# EAGLE design Nyan (EAGLE 6.6.0)
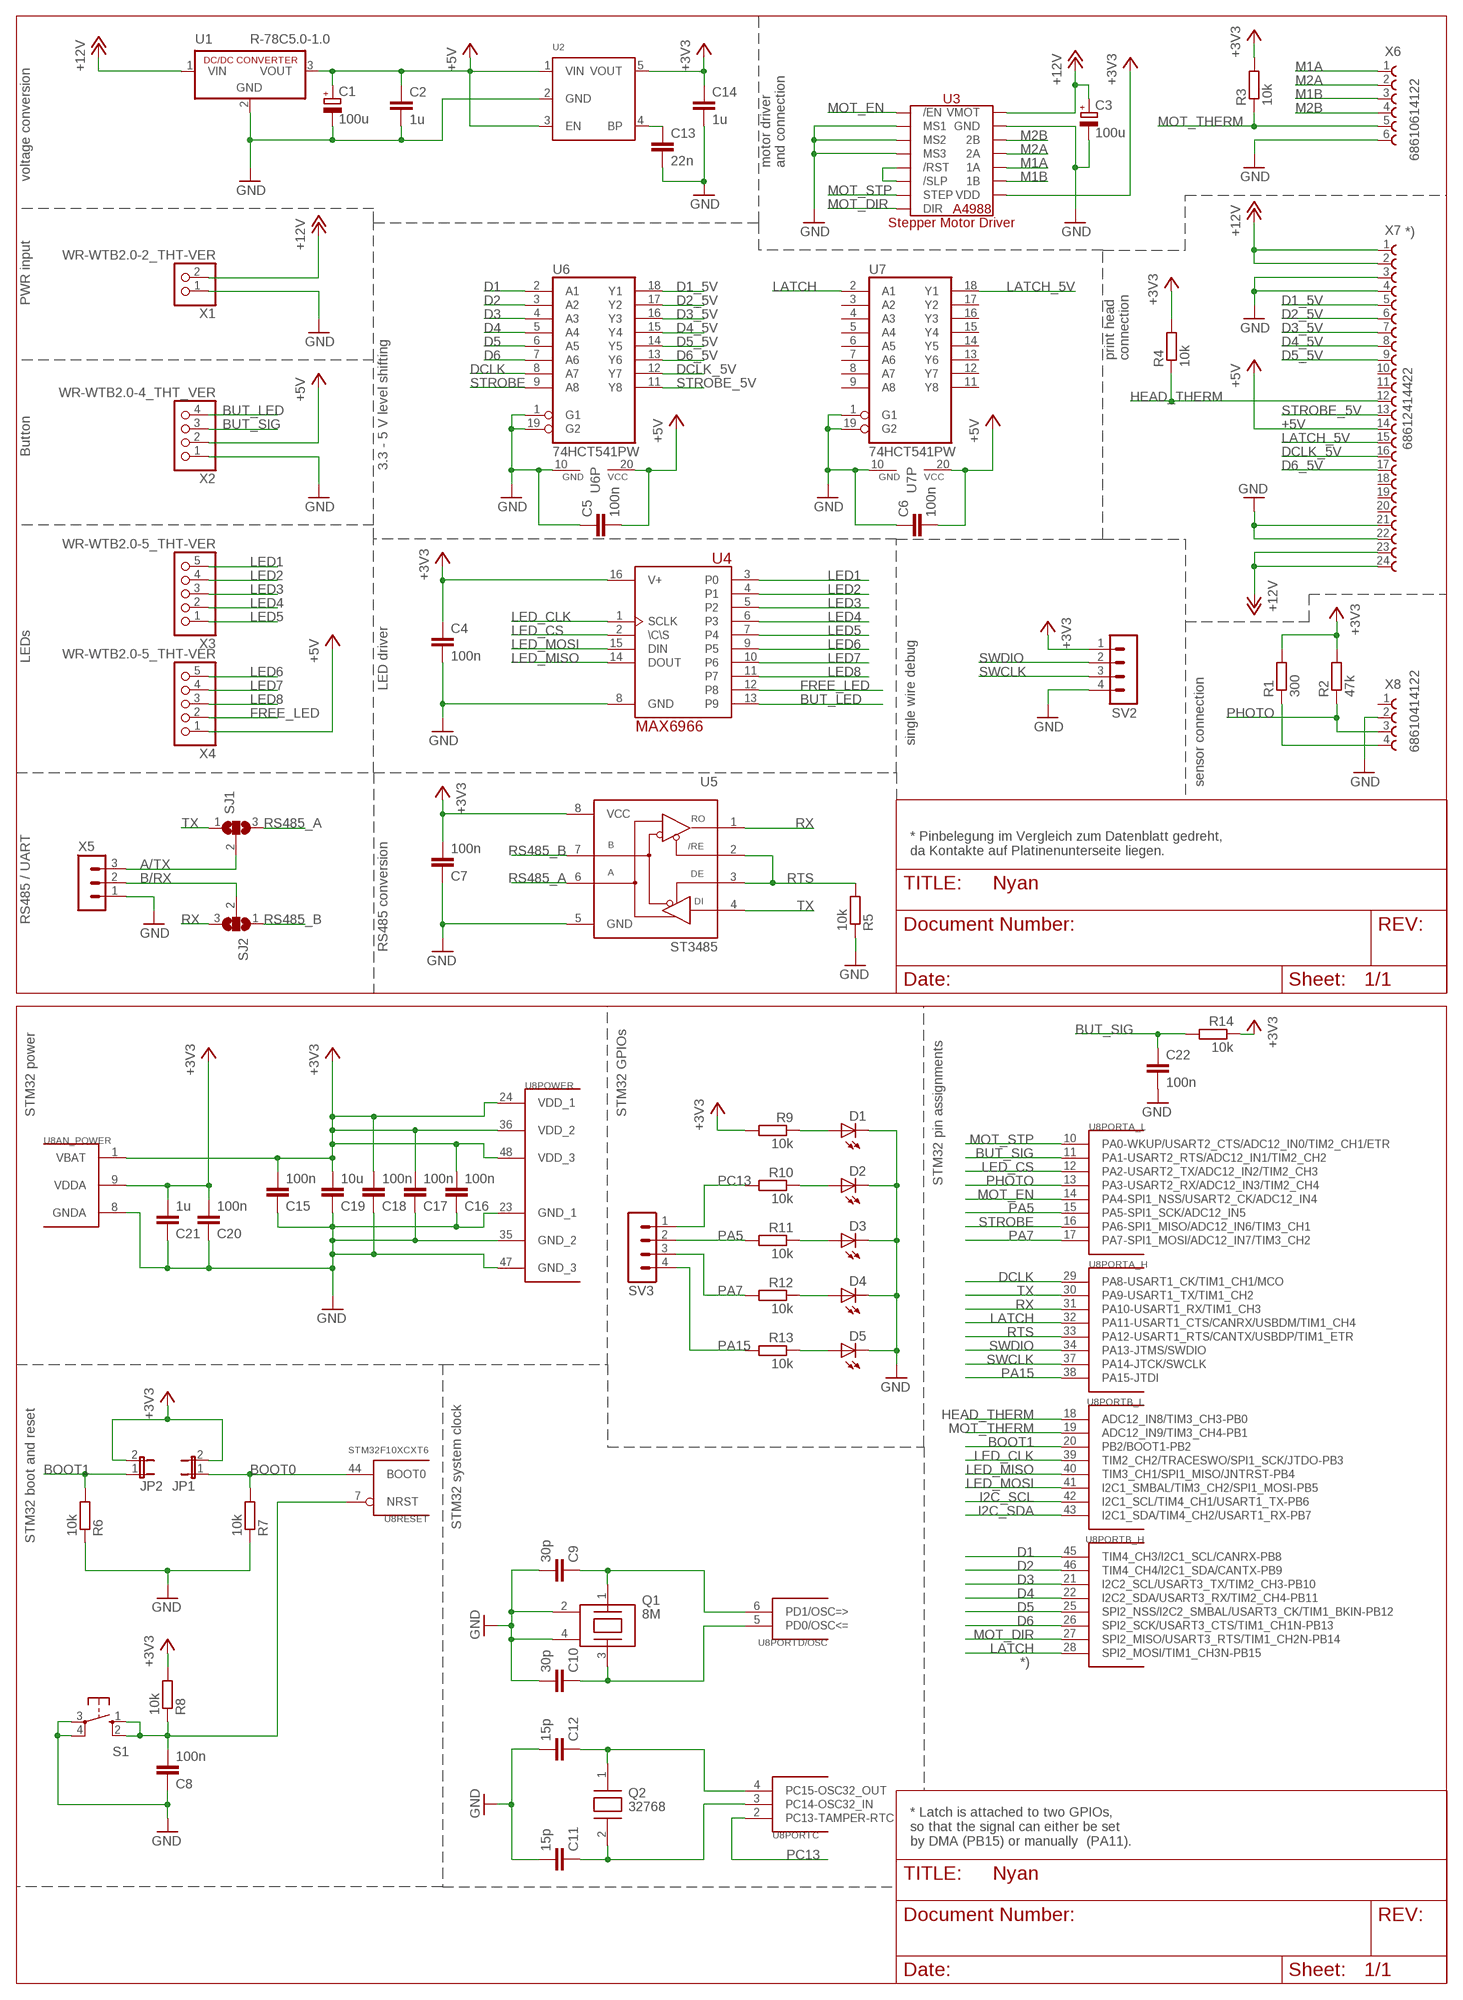
[diagram p0: schematic, sheet 1]

## Parts
C1  100u  CPOL-EUE2.5-6  [E2,5-6]
C2  1u  C-EUC0603  [C0603]
C3  100u  CPOL-EUE2.5-6  [E2,5-6]
C4  100n  C-EUC0603  [C0603]
C5  100n  C-EUC0603  [C0603]
C6  100n  C-EUC0603  [C0603]
C7  100n  C-EUC0603  [C0603]
C8  100n  C-EUC0603  [C0603]
C9  30p  C-EUC0603  [C0603]
C10  30p  C-EUC0603  [C0603]
C11  15p  C-EUC0603  [C0603]
C12  15p  C-EUC0603  [C0603]
C13  22n  C-EUC0603  [C0603]
C14  1u  C-EUC0603  [C0603]
C15  100n  C-EUC0603  [C0603]
C16  100n  C-EUC0603  [C0603]
C17  100n  C-EUC0603  [C0603]
C18  100n  C-EUC0603  [C0603]
C19  10u  C-EUC0603  [C0603]
C20  100n  C-EUC0603  [C0603]
C21  1u  C-EUC0603  [C0603]
C22  100n  C-EUC0603  [C0603]
D1  LEDCHIP-LED0603  [CHIP-LED0603]
D2  LEDCHIP-LED0603  [CHIP-LED0603]
D3  LEDCHIP-LED0603  [CHIP-LED0603]
D4  LEDCHIP-LED0603  [CHIP-LED0603]
D5  LEDCHIP-LED0603  [CHIP-LED0603]
JP1  JP1E  [JP1]
JP2  JP1E  [JP1]
Q1  8M  YSX531SL  [SMD_5X3.2]
Q2  32768  YST310S  [SMD_3.2X1.5]
R1  300  R-EU_R0603  [R0603]
R2  47k  R-EU_R0603  [R0603]
R3  10k  R-EU_R0603  [R0603]
R4  10k  R-EU_R0603  [R0603]
R5  10k  R-EU_R0603  [R0603]
R6  10k  R-EU_R0603  [R0603]
R7  10k  R-EU_R0603  [R0603]
R8  10k  R-EU_R0603  [R0603]
R9  10k  R-EU_R0603  [R0603]
R10  10k  R-EU_R0603  [R0603]
R11  10k  R-EU_R0603  [R0603]
R12  10k  R-EU_R0603  [R0603]
R13  10k  R-EU_R0603  [R0603]
R14  10k  R-EU_R0603  [R0603]
S1  6X6_MOMENTARY_SWITCH  [6X6_MOMENTARY_SWITCH]
SJ1  SJ2W  [SJ_2]
SJ2  SJ2W  [SJ_2]
SV2  MA04-1ROUND_PAD  [MA04-1_ROUND]
SV3  MA04-1ROUND_PAD  [MA04-1_ROUND]
U1  R-78C5.0-1.0  [SIP3]
U2  RT9193  [SOT23-5]
U3  A4988_STEP  [A4988_STEP]
U4  MAX6966  [QSOP-16]
U5  ST3485  [SO-08]
U6  74HCT541PW  [TSSOP20]
U7  74HCT541PW  [TSSOP20]
U8  STM32F10XCXT6  [TQFP48]
X1  WR-WTB2.0-2_THT-VER  [WR-WTB2.0-2-THT-VER]
X2  WR-WTB2.0-4_THT_VER  [WR-WTB2.0-4-THT-VER]
X3  WR-WTB2.0-5_THT-VER  [WR-WTB2.0-5-THT-VER]
X4  WR-WTB2.0-5_THT-VER  [WR-WTB2.0-5-THT-VER]
X5  MA03-1ROUND_PAD  [MA03-1_ROUND]
X6  68610614122  [68610614122]
X7  68612414422  [68612414422]
X8  68610414122  [68610414122]

## Nets
+3V3: C4.1 C7.2 C14.1 C15.2 C16.2 C17.2 C18.2 C19.2 C20.2 C21.2 JP1.2 JP2.2 R1.2 R2.2 R3.2 R4.2 R8.2 R9.2 R14.1 SV2.1 U2.5(VOUT) U3.VDD U4.16(V+) U5.8(VCC) U8.1(AN_POWER:VBAT) U8.9(AN_POWER:VDDA) U8.24(POWER:VDD_1) U8.36(POWER:VDD_2) U8.48(POWER:VDD_3)
+5V: C1.+ C2.1 C5.2 C6.2 U1.3(VOUT) U2.1(VIN) U2.3(EN) U6.20(VCC) U7.20(VCC) X2.2 X4.1 X7.14
+12V: C3.+ U1.1(VIN) U3.VMOT X1.2 X7.1 X7.2 X7.23 X7.24
A/TX: SJ1.2 X5.3
B/RX: SJ2.2 X5.2
BOOT0: JP1.1 R7.2 U8.44(RESET:BOOT0)
BOOT1: JP2.1 R6.2 U8.20(PORTB_L:PB2/BOOT1-PB2)
BUT_LED: U4.13(P9) X2.4
BUT_SIG: C22.1 R14.2 U8.11(PORTA_L:PA1-USART2_RTS/ADC12_IN1/TIM2_CH2) X2.3
D1: U6.2(A1) U8.45(PORTB_H:TIM4_CH3/I2C1_SCL/CANRX-PB8)
D1_5V: U6.18(Y1) X7.5
D2: U6.3(A2) U8.46(PORTB_H:TIM4_CH4/I2C1_SDA/CANTX-PB9)
D2_5V: U6.17(Y2) X7.6
D3: U6.4(A3) U8.21(PORTB_H:I2C2_SCL/USART3_TX/TIM2_CH3-PB10)
D3_5V: U6.16(Y3) X7.7
D4: U6.5(A4) U8.22(PORTB_H:I2C2_SDA/USART3_RX/TIM2_CH4-PB11)
D4_5V: U6.15(Y4) X7.8
D5: U6.6(A5) U8.25(PORTB_H:SPI2_NSS/I2C2_SMBAL/USART3_CK/TIM1_BKIN-PB12)
D5_5V: U6.14(Y5) X7.9
D6: U6.7(A6) U8.26(PORTB_H:SPI2_SCK/USART3_CTS/TIM1_CH1N-PB13)
D6_5V: U6.13(Y6) X7.17
DCLK: U6.8(A7) U8.29(PORTA_H:PA8-USART1_CK/TIM1_CH1/MCO)
DCLK_5V: U6.12(Y7) X7.16
FREE_LED: U4.12(P8) X4.2
GND: C1.- C2.2 C3.- C4.2 C5.1 C6.1 C7.1 C8.1 C9.2 C10.2 C11.2 C12.2 C13.2 C14.2 C15.1 C16.1 C17.1 C18.1 C19.1 C20.1 C21.1 C22.2 D1.C D2.C D3.C D4.C D5.C Q1.2 Q1.4 R5.1 R6.1 R7.1 S1.3 S1.4 SV2.4 U1.2(GND) U2.2(GND) U3.GND U3.GND2(GND) U3.MS1 U3.MS2 U3.MS3 U4.8(GND) U5.5(GND) U6.1(G1) U6.10(GND) U6.19(G2) U7.1(G1) U7.10(GND) U7.19(G2) U8.8(AN_POWER:GNDA) U8.23(POWER:GND_1) U8.35(POWER:GND_2) U8.47(POWER:GND_3) X1.1 X2.1 X5.1 X6.6 X7.3 X7.4 X7.21 X7.22 X8.2
HEAD_THERM: R4.1 U8.18(PORTB_L:ADC12_IN8/TIM3_CH3-PB0) X7.12
I2C_SCL: U8.42(PORTB_L:I2C1_SCL/TIM4_CH1/USART1_TX-PB6)
I2C_SDA: U8.43(PORTB_L:I2C1_SDA/TIM4_CH2/USART1_RX-PB7)
LATCH: U7.2(A1) U8.28(PORTB_H:SPI2_MOSI/TIM1_CH3N-PB15) U8.32(PORTA_H:PA11-USART1_CTS/CANRX/USBDM/TIM1_CH4)
LATCH_5V: U7.18(Y1) X7.15
LED1: U4.3(P0) X3.5
LED2: U4.4(P1) X3.4
LED3: U4.5(P2) X3.3
LED4: U4.6(P3) X3.2
LED5: U4.7(P4) X3.1
LED6: U4.9(P5) X4.5
LED7: U4.10(P6) X4.4
LED8: U4.11(P7) X4.3
LED_CLK: U4.1(SCLK) U8.39(PORTB_L:TIM2_CH2/TRACESWO/SPI1_SCK/JTDO-PB3)
LED_CS: U4.2(\C\S) U8.12(PORTA_L:PA2-USART2_TX/ADC12_IN2/TIM2_CH3)
LED_MISO: U4.14(DOUT) U8.40(PORTB_L:TIM3_CH1/SPI1_MISO/JNTRST-PB4)
LED_MOSI: U4.15(DIN) U8.41(PORTB_L:I2C1_SMBAL/TIM3_CH2/SPI1_MOSI-PB5)
M1A: U3.1A X6.1
M1B: U3.1B X6.3
M2A: U3.2A X6.2
M2B: U3.2B X6.4
MOT_DIR: U3.DIR U8.27(PORTB_H:SPI2_MISO/USART3_RTS/TIM1_CH2N-PB14)
MOT_EN: U3./EN U8.14(PORTA_L:PA4-SPI1_NSS/USART2_CK/ADC12_IN4)
MOT_STP: U3.STEP U8.10(PORTA_L:PA0-WKUP/USART2_CTS/ADC12_IN0/TIM2_CH1/ETR)
MOT_THERM: R3.1 U8.19(PORTB_L:ADC12_IN9/TIM3_CH4-PB1) X6.5
N$1: R1.1 X8.4
N$2: U3./RST U3./SLP
N$8: C8.2 R8.1 S1.1 S1.2 U8.7(RESET:NRST)
N$9: C12.1 Q2.1 U8.4(PORTC:PC15-OSC32_OUT)
N$10: C11.1 Q2.2 U8.3(PORTC:PC14-OSC32_IN)
N$11: C10.1 Q1.3 U8.5(PORTD/OSC:PD0/OSC<=)
N$14: C9.1 Q1.1 U8.6(PORTD/OSC:PD1/OSC=>)
N$15: D4.A R12.1
N$16: D1.A R9.1
N$17: D2.A R10.1
N$18: D3.A R11.1
N$19: C13.1 U2.4(BP)
N$20: D5.A R13.1
PA5: R11.2 SV3.2 U8.15(PORTA_L:PA5-SPI1_SCK/ADC12_IN5)
PA7: R12.2 SV3.3 U8.17(PORTA_L:PA7-SPI1_MOSI/ADC12_IN7/TIM3_CH2)
PA15: R13.2 SV3.4 U8.38(PORTA_H:PA15-JTDI)
PC13: R10.2 SV3.1 U8.2(PORTC:PC13-TAMPER-RTC)
PHOTO: R2.1 U8.13(PORTA_L:PA3-USART2_RX/ADC12_IN3/TIM2_CH4) X8.3
RS485_A: SJ1.3 U5.6(A)
RS485_B: SJ2.1 U5.7(B)
RTS: R5.2 U5.2(!RE) U5.3(DE) U8.33(PORTA_H:PA12-USART1_RTS/CANTX/USBDP/TIM1_ETR)
RX: SJ2.3 U5.1(RO) U8.31(PORTA_H:PA10-USART1_RX/TIM1_CH3)
STROBE: U6.9(A8) U8.16(PORTA_L:PA6-SPI1_MISO/ADC12_IN6/TIM3_CH1)
STROBE_5V: U6.11(Y8) X7.13
SWCLK: SV2.3 U8.37(PORTA_H:PA14-JTCK/SWCLK)
SWDIO: SV2.2 U8.34(PORTA_H:PA13-JTMS/SWDIO)
TX: SJ1.1 U5.4(DI) U8.30(PORTA_H:PA9-USART1_TX/TIM1_CH2)
Unconnected: U7.3(A2) U7.4(A3) U7.5(A4) U7.6(A5) U7.7(A6) U7.8(A7) U7.9(A8) U7.11(Y8) U7.12(Y7) U7.13(Y6) U7.14(Y5) U7.15(Y4) U7.16(Y3) U7.17(Y2) X7.10 X7.11 X7.18 X7.19 X7.20 X8.1

## Notes on the sheet
- motor driver 
  and connection
- voltage conversion
- *)
- PWR input
- print head
  connection
- Button
- 3.3 - 5 V level shifting
- LEDs
- LED driver
- single wire debug
- sensor connection
- * Pinbelegung im Vergleich zum Datenblatt gedreht,
  da Kontakte auf Platinenunterseite liegen.
- RS485 / UART
- RS485 conversion
- STM32 power | STM32 GPIOs
- STM32 pin assignments
- STM32 system clock
- STM32 boot and reset
- *)
- * Latch is attached to two GPIOs, 
  so that the signal can either be set 
  by DMA (PB15) or manually  (PA11).

## Library data of the parts
C1 C3 = rcl:CPOL-EU: POLARIZED CAPACITOR, European symbol
C2 C4-C22 = rcl:C-EU: CAPACITOR, European symbol
D1-D5 = led:LED: LED OSRAM: - CHIPLED LG R971, LG N971, LY N971, LG Q971, LY Q971, LO R971, LY R971 LH N974, LH R974 LS Q976, LO Q976, LY Q976 LO Q996 - Hyper CHIPLED LW Q18S LB Q993, LB Q99A, LB R99A - SideLED LS A670, LO A670, LY A670, LG A670, LP A670 LB A673, LV A673, LT A673, LW A673 LH A674 LY A675 LS A676, LA A676, LO A676, LY A676, LW A676 LS A679, LY A679, LG A679 - Hyper Micro SIDELED® LS Y876, LA Y876, LO Y876, LY Y876 LT Y87S - SmartLED LW L88C, LW L88S LB L89C, LB L89S, LG L890 LS L89K, LO L89K, LY L89K LS L896, LA L896, LO L896, LY L896 - TOPLED LS T670, LO T670, LY T670, LG T670, LP T670 LSG T670, LSP T670, LSY T670, LOP T670, LYG T670 LG T671, LOG T671, LSG T671 LB T673, LV T673, LT T673, LW T673 LH T674 LS T676, LA T676, LO T676, LY T676, LB T676, LH T676, LSB T676, LW T676 LB T67C, LV T67C, LT T67C, LS T67K, LO T67K, LY T67K, LW E67C LS E67B, LA E67B, LO E67B, LY E67B, LB E67C, LV E67C, LT E67C LW T67C LS T679, LY T679, LG T679 LS T770, LO T770, LY T770, LG T770, LP T770 LB T773, LV T773, LT T773, LW T773 LH T774 LS E675, LA E675, LY E675, LS T675 LS T776, LA T776, LO T776, LY T776, LB T776 LHGB T686 LT T68C, LB T68C - Hyper Mini TOPLED® LB M676 - Mini TOPLED Santana® LG M470 LS M47K, LO M47K, LY M47K Source: http://www.osram.convergy.de LUXEON: - LUMILED® LXK2-PW12-R00, LXK2-PW12-S00, LXK2-PW14-U00, LXK2-PW14-V00 LXK2-PM12-R00, LXK2-PM12-S00, LXK2-PM14-U00 LXK2-PE12-Q00, LXK2-PE12-R00, LXK2-PE12-S00, LXK2-PE14-T00, LXK2-PE14-U00 LXK2-PB12-K00, LXK2-PB12-L00, LXK2-PB12-M00, LXK2-PB14-N00, LXK2-PB14-P00, LXK2-PB14-Q00 LXK2-PR12-L00, LXK2-PR12-M00, LXK2-PR14-Q00, LXK2-PR14-R00 LXK2-PD12-Q00, LXK2-PD12-R00, LXK2-PD12-S00 LXK2-PH12-R00, LXK2-PH12-S00 LXK2-PL12-P00, LXK2-PL12-Q00, LXK2-PL12-R00 Source: www.luxeon.com KINGBRIGHT: KA-3528ASYC Source: www.kingbright.com
JP1 JP2 = jumper:JP1E: JUMPER; REICHELT: SL 1X36G 2,54
Q1 = Crystals:YSX531SL; HERSTELLER: Yangxing Tech; LCSC: C157341
Q2 = Crystals:YST310S; HERSTELLER: Yangxing Tech; LCSC: C94279
R1-R14 = rcl:R-EU_: RESISTOR, European symbol
S1 = Taster:6X6_MOMENTARY_SWITCH
SJ1 SJ2 = jumper:SJ2W: SMD solder JUMPER
SV2 SV3 = con-lstb:MA04-1: PIN HEADER; REICHELT: MPE 087-1-004
U1 = dc-dc-converter:R-78C*-1.0: INNOLINE DC/DC-Converter 1.0 AMP SIP3 Single Output Source: Data sheet <http://www.mikrocontroller.net/attachment/150645/157764-da-01-en-DC_DC_WANDLER_R_78C5_0_1_0.pdf>
U2 = Power:RT9193
U3 = IC:A4988_STEP
U4 = meineLibrary:MAX6966
U5 = TURAG_misc:ST3485: RS485-Transciever 3,3V; FARNELL: 1842628
U6 U7 = 74xx:74*541: Octal BUFFER and LINE DRIVER, 3-state; HERSTELLER: Nexperia; LCSC: C131314
U8 = TURAG_Mikrocontroller:STM32F10XCXT6: ST STM32F101/103 48pin LQFP
X1 = TURAG_Steckverbinder:WR-WTB2.0-2; WUERTH: 62000211622:620002113322
X2 = TURAG_Steckverbinder:WR-WTB2.0-4; WUERTH: 62000411622:620004113322
X3 X4 = TURAG_Steckverbinder:WR-WTB2.0-5; WUERTH: 62000511622:620005113322
X5 = con-lstb:MA03-1: PIN HEADER; REICHELT: MPE 087-1-003
X6 = Wuerth_Elektronik_eiCan_03_ZIF_Connectors_Flat_Flexible_Cable:68610614122: WR-FPC 1.00mm SMT ZIF Horizontal Top Contact, 6 Pins
X7 = Wuerth_Elektronik_eiCan_03_ZIF_Connectors_Flat_Flexible_Cable:68612414422: WR-FPC 1.00mm SMT ZIF Horizontal Bottom Contact, 24 Pins
X8 = Wuerth_Elektronik_eiCan_03_ZIF_Connectors_Flat_Flexible_Cable:68610414122: WR-FPC 1.00mm SMT ZIF Horizontal Top Contact, 4 Pins

## Board
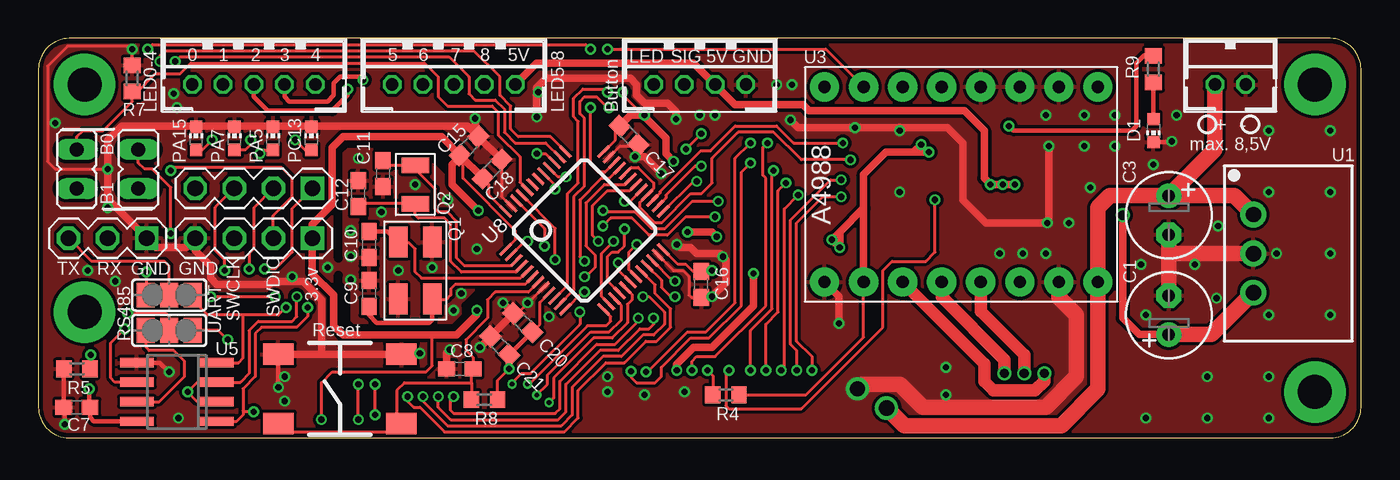
[diagram p1: board, top side]
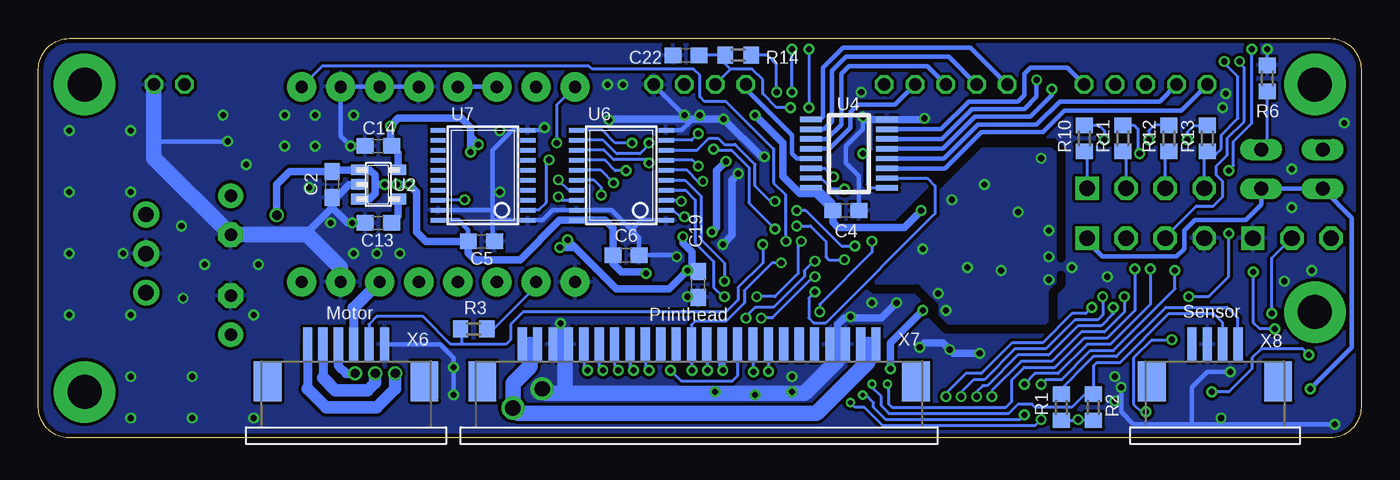
[diagram p2: board, bottom side, seen from below]

Size 86 x 26 mm. Coordinates in mm from the lower left corner, seen from the top.
Outline: 2,0 84,0 arc90 86,2 86,24 arc90 84,26 2,26 arc90 0,24 0,2 arc90 2,0
Copper layers (1*16): Top 0.035mm / dielectric 1.6mm / Bottom 0.035mm
Design rules "jlcpcb2layer": minimum track width 5mil, minimum drill 0.2mm, track to track 5mil, track to pad 5mil, pad to pad 5mil, via to via 5mil, smd to smd 0mil, copper to edge 0.2mm, drill to drill 0.2mm, minimum pad ring 6mil, minimum via ring 6mil, stop-mask expansion 4mil, vias tented up to drill 0.5mm, thermal gap 0.2mm
tRestrict: 17 lines
bRestrict: 17 lines

### Footprints (pad centres in the part's own frame; a part is rotated, then mirrored left to right if it is on the bottom)
E2,5-6 = drill 0.813 pad 1.6: + -1.27,0 | drill 0.813 pad 1.6 octagon: - 1.27,0
C0603 = smd 1.1 x 1: 1 -0.85,0; 2 0.85,0
CHIP-LED0603 = smd 0.8 x 0.8: A 0,-0.75; C 0,0.75
JP1 = drill 0.914 long: 1 0,-1.27; 2 0,1.27
SMD_5X3.2 = smd 2 x 1.2: 1 -1.85,-1.1; 2 1.85,-1.1; 3 1.85,1.1; 4 -1.85,1.1
SMD_3.2X1.5 = smd 1 x 1.8: 1 -1.25,0; 2 1.25,0
R0603 = smd 1 x 1.1: 1 -0.85,0; 2 0.85,0
6X6_MOMENTARY_SWITCH = smd 2 x 1.4: 1 -4,2.25; 2 4,2.25; 3 -4,-2.25; 4 4,-2.25
SJ_2 = smd 1.168 x 1.6: 1 -1.524,0; 2 0,0; 3 1.524,0
MA04-1_ROUND = drill 1.016 square: 1 -3.81,0 | drill 1.016 octagon: 2 -1.27,0; 3 1.27,0; 4 3.81,0
SIP3 = drill 1 pad 1.676: 1 -2.54,0; 2 0,0; 3 2.54,0
SOT23-5 = smd 0.69 x 0.99: 1 -0.95,-1.29; 2 0,-1.29; 3 0.95,-1.29; 4 0.95,1.3; 5 -0.95,1.3
A4988_STEP = drill 0.8 pad 1.905: 1A 6.35,-1.27; 1B 6.35,-3.81; 2A 6.35,1.27; 2B 6.35,3.81; /EN -6.35,8.89; /RST -6.35,-1.27; /SLP -6.35,-3.81; DIR -6.35,-8.89; GND 6.35,6.35; GND2 6.35,-8.89; MS1 -6.35,6.35; MS2 -6.35,3.81; MS3 -6.35,1.27; STEP -6.35,-6.35; VDD 6.35,-6.35; VMOT 6.35,8.89
QSOP-16 = smd 0.35 x 1.45: 1 -2.223,-2.475; 2 -1.587,-2.475; 3 -0.953,-2.475; 4 -0.318,-2.475; 5 0.318,-2.475; 6 0.953,-2.475; 7 1.587,-2.475; 8 2.223,-2.475; 9 2.223,2.475; 10 1.587,2.475; 11 0.953,2.475; 12 0.318,2.475; 13 -0.318,2.475; 14 -0.953,2.475; 15 -1.587,2.475; 16 -2.223,2.475
SO-08 = smd 0.6 x 2.2: 1 -1.905,-2.6; 2 -0.635,-2.6; 3 0.635,-2.6; 4 1.905,-2.6; 5 1.905,2.6; 6 0.635,2.6; 7 -0.635,2.6; 8 -1.905,2.6
TSSOP20 = smd 0.305 x 0.991: 1 -2.925,-2.918; 2 -2.275,-2.918; 3 -1.625,-2.918; 4 -0.975,-2.918; 5 -0.325,-2.918; 6 0.325,-2.918; 7 0.975,-2.918; 8 1.625,-2.918; 9 2.275,-2.918; 10 2.925,-2.918; 11 2.925,2.918; 12 2.275,2.918; 13 1.625,2.918; 14 0.975,2.918; 15 0.325,2.918; 16 -0.325,2.918; 17 -0.975,2.918; 18 -1.625,2.918; 19 -2.275,2.918; 20 -2.925,2.918
TQFP48 = smd 0.2 x 1: 1 -2.75,-4.5; 2 -2.25,-4.5; 3 -1.75,-4.5; 4 -1.25,-4.5; 5 -0.75,-4.5; 6 -0.25,-4.5; 7 0.25,-4.5; 8 0.75,-4.5; 9 1.25,-4.5; 10 1.75,-4.5; 11 2.25,-4.5; 12 2.75,-4.5; 25 2.75,4.5; 26 2.25,4.5; 27 1.75,4.5; 28 1.25,4.5; 29 0.75,4.5; 30 0.25,4.5; 31 -0.25,4.5; 32 -0.75,4.5; 33 -1.25,4.5; 34 -1.75,4.5; 35 -2.25,4.5; 36 -2.75,4.5 | smd 1 x 0.2: 13 4.5,-2.75; 14 4.5,-2.25; 15 4.5,-1.75; 16 4.5,-1.25; 17 4.5,-0.75; 18 4.5,-0.25; 19 4.5,0.25; 20 4.5,0.75; 21 4.5,1.25; 22 4.5,1.75; 23 4.5,2.25; 24 4.5,2.75; 37 -4.5,2.75; 38 -4.5,2.25; 39 -4.5,1.75; 40 -4.5,1.25; 41 -4.5,0.75; 42 -4.5,0.25; 43 -4.5,-0.25; 44 -4.5,-0.75; 45 -4.5,-1.25; 46 -4.5,-1.75; 47 -4.5,-2.25; 48 -4.5,-2.75
WR-WTB2.0-2-THT-VER = drill 0.8 octagon: 1 1,0; 2 -1,0
WR-WTB2.0-4-THT-VER = drill 0.8 octagon: 1 3,0; 2 1,0; 3 -1,0; 4 -3,0
WR-WTB2.0-5-THT-VER = drill 0.8 octagon: 1 4,0; 2 2,0; 3 0,0; 4 -2,0; 5 -4,0
MA03-1_ROUND = drill 1.016 square: 1 -2.54,0 | drill 1.016 octagon: 2 0,0; 3 2.54,0
68610614122 = smd 0.6 x 2.2: 1 -2.5,1.1; 2 -1.5,1.1; 3 -0.5,1.1; 4 0.5,1.1; 5 1.5,1.1; 6 2.5,1.1 | smd 1.8 x 2.6: Z1 -5.1,-1.3; Z2 5.1,-1.3
68612414422 = smd 0.6 x 2.2: 1 -11.54,1.1; 2 -10.54,1.1; 3 -9.54,1.1; 4 -8.54,1.1; 5 -7.54,1.1; 6 -6.54,1.1; 7 -5.54,1.1; 8 -4.54,1.1; 9 -3.54,1.1; 10 -2.54,1.1; 11 -1.54,1.1; 12 -0.54,1.1; 13 0.46,1.1; 14 1.46,1.1; 15 2.46,1.1; 16 3.46,1.1; 17 4.46,1.1; 18 5.46,1.1; 19 6.46,1.1; 20 7.46,1.1; 21 8.46,1.1; 22 9.46,1.1; 23 10.46,1.1; 24 11.46,1.1 | smd 1.8 x 2.6: Z1 -14.14,-1.3; Z2 14.06,-1.3
68610414122 = smd 0.6 x 2.2: 1 -1.5,1.1; 2 -0.5,1.1; 3 0.5,1.1; 4 1.5,1.1 | smd 1.8 x 2.6: Z1 -4.1,-1.3; Z2 4.1,-1.3

### Placement (x,y rotation side)
C1  73.5,8 90 top
C2  66.9,16.5 270 bottom
C3  73.5,14.5 270 top
C4  33.5,14.8 0 bottom
C5  57.2,12.8 180 bottom
C6  47.8,11.9 180 bottom
C7  2.5,2 0 top
C8  27.4,4.5 0 top
C9  21.5,9.4 90 top
C10  21.5,12.6 270 top
C11  22.4,17.2 270 top
C12  20.8,15.9 90 top
C13  63.9,14 180 bottom
C14  63.9,19 180 bottom
C15  28,19 225 top
C16  43.1,10 90 top
C17  38.4,19.7 135 top
C18  29.5,17.5 225 top
C19  43.1,10 90 bottom
C20  31.5,7.5 315 top
C21  30,6 315 top
C22  43.9,24.9 180 bottom
D1  72.5,20 180 top
D2  17.75,19.5 0 top
D3  15.25,19.5 0 top
D4  12.75,19.5 0 top
D5  10.25,19.5 0 top
JP1  2.5,17.5 180 top
JP2  6.5,17.5 180 top
Q1  24.5,10.9 90 top
Q2  24.5,16.5 90 top
R1  19.5,2 270 bottom
R2  17.4,2 270 bottom
R3  57.7,7.1 0 bottom
R4  44.7,2.8 0 top
R5  2.5,4.5 0 top
R6  6.1,23.4 270 bottom
R7  6.1,23.4 270 top
R8  29,2.5 0 top
R9  72.5,24 90 top
R10  18,19.5 270 bottom
R11  15.5,19.5 270 bottom
R12  12.5,19.5 270 bottom
R13  10,19.5 270 bottom
R14  40.5,24.9 180 bottom
S1  19.6,3.2 180 top
SJ1  8.5,9.3 180 top
SJ2  8.5,7 0 top
SV2  14,13 180 top
SV3  14,16.25 180 top
U1  79,12 270 top
U2  63.9,16.5 270 bottom
U3  60,16.5 270 top
U4  33.3,18.5 90 bottom
U5  9,3 90 top
U6  48.1,17.1 90 bottom
U7  57.1,17.1 90 bottom
U8  35.5,13.5 315 top
X1  77.5,23 0 top
X2  43,23 0 top
X3  14,23 0 top
X4  27,23 0 top
X5  4.5,13 180 top
X6  66,5 0 bottom
X7  43,5 0 bottom
X8  9.5,5 0 bottom

### Tracks (layer width: path | path; a pad name or v marks a point on that pad's centre or on a via)
+3V3  (via drill 0.4)
  Top 0.2: U8.48 29.3,15.81 29.3,16.5 C18.2 | U8.1 31,12.89 31,13.5 27.6,16.9 27.6,18.2 C15.2 | C20.2 32.6,7.4 32.6,8.83 U8.9 | R8.2 29.85,3.75 v30.6,4.5 | U8.36 37.51,19.4 37.51,20.01 C17.2 | v18.4,1.2 18.4,3.6 19.1,4.3 25.2,4.3 25.6,4.7 25.6,6.5 25.4,6.7 | C16.2 42.55,10.85 42.1,11.3 41.59,11.3 U8.24 | R4.2 49.9,2.8 53.65,6.55 U3.VDD | v38,22.5 38,22.3 39.3,21 v39.4,21
  Top 0.3: U5.8 3.6,1.09 3.35,1.35 C7.2 3.3,2.05 v3.3,3.2 | C20.2 C21.2 | R9.2 72.45,24.9 71.9,24.9 71.4,24.4 71.4,20.3 71.1,20 63.4,20 v63.1,20.3
  Top 0.5: C18.2 C15.2 | C15.2 26.2,19.6 19.8,19.6 19.1,18.9 19.1,15.19 17.81,13.9 SV2.1 17.81,10.69 19.2,9.3 19.2,7.3 19.8,6.7 25.4,6.7 27.2,6.7 28.5,8 v28.5,8.3 | v30.6,4.5 C21.2 | v41.3,18 40.8,18.5 40.8,19.5 39.4,20.9 v39.4,21 38.5,21 C17.2 | C16.2 43.75,10.85 v43.8,10.9 | v42.2,13.4 43.8,13.4 v44.1,13.1 | U3.VDD 53.65,14.95 | 53.65,14.95 53.65,17.15 55.1,18.6 56.9,18.6 | 56.9,18.6 v57.9,18.6 | 52.1,13.4 v51.6,12.9 v52.1,12.4 52.1,13.4 | 52.1,13.4 53.65,14.95 | v57.4,19.1 56.9,18.6 | v28.6,14.8 26.9,16.5 26.9,17.8 27.4,18.3 C15.2
  Bottom 0.2: R2.2 18.35,1.15 v18.4,1.2 18.45,1.15 R1.2 | U3.VDD 53.65,9.85 56.4,7.1 R3.2 | v38,22.5 38,24.3 38.6,24.9 R14.1
  Bottom 0.3: v3.3,3.2 0.6,5.9 0.6,14.33 JP1.2 JP2.2 6.5,15.2 7.5,14.2 10.8,14.2 11.5,13.5 11.5,12.3 12,11.8 16.81,11.8 17.81,12.8 SV2.1 | C4.1 34.35,15.35 35.28,16.28 U4.16
  Bottom 0.5: v28.5,8.3 30.6,6.2 v30.6,4.5 | v41.3,18 41.9,17.4 41.9,13.7 v42.2,13.4 | v43.8,10.9 43.75,10.85 C16.2 | v43.8,10.9 43.5,11.2 43.5,12.1 44.1,12.7 v44.1,13.1 | U2.5 62.6,18.55 C14.1 63.1,19.05 v63.1,20.3 62.6,20.8 58.5,20.8 57.9,20.2 57.9,19.6 | v43.8,10.9 45,9.7 48.4,9.7 51.1,12.4 | 51.1,12.4 v51.6,12.9 | 57.9,19.6 v57.9,18.6 | v52.1,12.4 51.1,12.4 | v57.4,19.1 57.9,19.6 | v39.4,21 37.6,19.2 37.6,17 36.5,15.9 35.45,15.9 C4.1 34.35,14.05 34,13.7 29.7,13.7 v28.6,14.8
+5V  (via drill 0.4, 0.6)
  Top 0.5: X4.1 32.4,24.4 42.6,24.4 X2.2 45.3,21.7 49.7,21.7 50.1,21.3 60.2,21.3 61.5,20 61.5,16.9 v61.9,16.5 v63.5,16.5 | v41.5,4.4 41.5,4.8 42.6,5.9 43.8,5.9 46.5,8.6 v46.5,10.7 | v70.5,14.5 70.5,7.8 71.57,6.73 C1.+
  Top 1: U1.3 76.27,6.73 C1.+
  Bottom 0.2: X7.14 41.5,6.06 | 41.54,4.44 v41.5,4.4
  Bottom 0.3: U7.20 58.67,14.18 58.05,13.55 C5.2 | 63.9,16.5 64.1,16.3
  Bottom 0.5: U2.3 64.45,15.55 64.1,15.9 64.1,16.3 64.1,17.1 64.45,17.45 U2.1 66.8,17.45 C2.1 69.65,17.35 70.5,16.5 v70.5,14.5 | 48.65,12.25 C6.2 | X7.14 41.54,4.44 | C6.2 48.65,11.35 48.1,10.8 46.6,10.8 v46.5,10.7 | 63.9,16.5 v63.5,16.5 v62.7,16.5 v61.9,16.5 61.4,16 61.4,13.4 60.8,12.8 C5.2 58.05,12.05 57.6,11.6 54.7,11.6 52.12,14.18 U6.20 49.17,14.18 48.65,13.65 C6.2
+12V  (via drill 1)
  Top 1: C3.+ 77.77,15.77 U1.1 | X1.2 76.5,18.77 C3.+ | v55.15,1.95 56.3,0.8 66.5,0.8 68.89,3.19 U3.VMOT 68.89,14.99 69.67,15.77 C3.+
  Bottom 0.5: X7.2 54.05,6.1 X7.1 | X7.24 32.05,6.1 X7.23
  Bottom 1: 32.05,6.1 32.05,4.95 35.4,1.6 54.8,1.6 v55.15,1.95 55.15,3.55 54.05,4.65 54.05,6.1
A/TX
  Top 0.2: SJ1.2 8.5,11.2 8.2,11.5 3.46,11.5 X5.3
B/RX  (via drill 0.4)
  Top 0.2: v5.8,8.1 8.3,8.1 8.5,7.9 SJ2.2
  Bottom 0.2: v5.8,8.1 5.8,11.7 X5.2
BOOT0
  Top 0.2: JP1.1 2.5,19.6 2.9,20 4.2,20 6.1,21.9 R7.2 6.45,22.55 7.6,23.7 9.2,23.7 9.9,24.4 25.1,24.4 26,23.5 26,22.2 26.6,21.6 29.5,21.6 29.9,21.2 29.9,19.7 31.3,18.3 31.3,16.64 U8.44
BOOT1  (via drill 0.4)
  Top 0.2: v11.2,9.2 v15.4,9.2 | v24,2.7 24,2.4 24.4,2 24.8,2 26.4,0.4 34.2,0.4 35.1,1.3 35.1,3.1 36.9,4.9 38.1,4.9 39.5,6.3 40.2,6.3 41.1,7.2 41.1,8.4 40.1,9.4 40.1,9.96 U8.20 | JP2.1 6.5,17.9 6.9,17.5 7.4,17.5 8.6,16.3 v8.6,13.3
  Bottom 0.2: 6.4,22.25 R6.2 6.1,19.17 JP2.1 | v15.4,9.2 15.4,8.2 16.7,6.9 18.2,6.9 20.1,5 22.1,5 24,3.1 v24,2.7 | v11.2,9.2 9.9,9.2 8.6,10.5 v8.6,13.3
BUT_LED
  Bottom 0.3: U4.13 36.68,18.18 37,18.5 37,19.7 40,22.7 X2.4
BUT_SIG  (via drill 0.4)
  Top 0.2: U8.11 34.8,9.62 34.8,15.7 35.5,16.4 35.5,20.8 35.2,21.1 35.2,21.9 35.5,22.2 36.3,22.2 37,21.5 v37.1,21.5
  Bottom 0.2: 41,24 39.6,24 38.9,23.3 38.9,22.4 38,21.5 v37.1,21.5 | 41,24 X2.3 | C22.1 R14.2 41.35,24.35 41,24
D1  (via drill 0.4)
  Top 0.2: U8.45 33.6,13.63 v33.6,11.6 | v36.7,13.8 37.2,14.3 38.6,14.3 39.7,13.2 40.9,13.2 42.1,14.4 v44,14.4
  Bottom 0.2: U6.2 44.73,14.82 44.3,14.4 v44,14.4 | v36.7,13.8 35.8,13.8 34.8,12.8 34.8,11.8 34.6,11.6 v33.6,11.6
D1_5V  (via drill 0.4)
  Top 0.2: v50.3,4.4 50.3,5.3 49.3,6.3 49.3,14 51,15.7 51.1,15.7 51.5,15.7 v52.2,15.7
  Bottom 0.2: X7.5 50.54,4.64 v50.3,4.4 | v52.2,15.7 51.98,15.47 U6.18
D2  (via drill 0.4)
  Top 0.2: U8.46 32.9,13.62 v32.9,12.5 | v36.7,14.8 36.8,14.7 38.8,14.7 39.9,13.6 40.7,13.6 42.5,15.4 v44.2,15.4
  Bottom 0.2: U6.3 44.27,15.47 v44.2,15.4 | v36.7,14.8 36.1,14.8 33.8,12.5 v32.9,12.5
D2_5V  (via drill 0.4)
  Top 0.2: v49.3,4.4 49.3,5.7 48.9,6.1 48.9,14.2 51.5,16.8 v52.2,16.8
  Bottom 0.2: X7.6 49.54,4.64 v49.3,4.4 | v52.2,16.8 51.52,16.12 U6.17
D3  (via drill 0.4)
  Top 0.2: U8.21 40.5,10.27 40.5,9.8 41.1,9.2 v41.4,9.2
  Bottom 0.2: U6.4 43.92,16.12 43.3,15.5 43.3,12.7 42.1,11.5 42.1,9.8 41.5,9.2 v41.4,9.2
D3_5V  (via drill 0.4)
  Top 0.2: v48.3,4.4 48.5,4.6 48.5,14.9 v49.4,15.8
  Bottom 0.2: v49.4,15.8 49.4,16.3 49.88,16.77 U6.16 | X7.7 48.54,4.64 v48.3,4.4
D4  (via drill 0.4)
  Top 0.2: U8.22 41.27,10.2 v41.4,10.2
  Bottom 0.2: U6.5 43.98,16.77 42.9,15.7 42.9,12.9 41.4,11.4 v41.4,10.2
D4_5V  (via drill 0.4)
  Top 0.2: v47.3,4.4 47.3,7.4 48.1,8.2 48.1,16.1 v48.6,16.6
  Bottom 0.2: U6.15 49.42,17.43 v48.6,16.6 | X7.8 47.54,4.64 v47.3,4.4
D5  (via drill 0.4)
  Top 0.2: U8.25 42.59,16.7 v42.8,16.7
  Bottom 0.2: U6.6 43.83,17.43 43.1,16.7 v42.8,16.7
D5_5V  (via drill 0.4)
  Top 0.2: v46.3,4.4 46.3,7 47.7,8.4 47.7,17.3 v47.8,17.4
  Bottom 0.2: v47.8,17.4 48.5,17.4 49.17,18.07 U6.14 | X7.9 46.54,4.64 v46.3,4.4
D6  (via drill 0.4)
  Top 0.2: v43.1,17.7 42.7,17.7 40.8,15.8 40.8,15.62 U8.26
  Bottom 0.2: v43.1,17.7 43.48,18.07 U6.7
D6_5V  (via drill 0.4)
  Top 0.2: v38.54,4.34 38.54,3.96 38.9,3.6 40.1,3.6 40.5,4 40.5,4.6 42.4,6.5 43.6,6.5 45.7,8.6 45.7,17.3 v46.3,17.9
  Bottom 0.2: U6.13 49.23,18.73 48.6,18.1 46.5,18.1 v46.3,17.9 | X7.17 v38.54,4.34
DCLK  (via drill 0.4)
  Top 0.2: v38.1,15.4 38.46,15.4 U8.29
  Bottom 0.2: U6.8 43.17,18.73 42.4,19.5 41.8,19.5 41.4,19.1 40.7,19.1 39.4,17.8 39.4,16.4 38.4,15.4 v38.1,15.4
DCLK_5V  (via drill 0.4)
  Top 0.2: v39.5,4.3 39.6,4.3 42.2,6.9 43.4,6.9 45.3,8.8 45.3,18.2 v46.3,19.2
  Bottom 0.2: U6.12 49.27,19.38 48.4,18.5 46.9,18.5 46.3,19.1 v46.3,19.2 | X7.16 39.54,4.34 v39.5,4.3
FREE_LED
  Bottom 0.3: U4.12 34.58,18.82 33.2,20.2 33.2,21.2 32.7,21.7 30.3,21.7 X4.2
GND  (via drill 0.4, 1)
  Top 0.2: C20.1 31.16,8.1 U8.8 | 7.4,20.4 7.5,20.3 | C18.1 30.1,15.72 U8.47 | U8.35 37.82,19 38.9,19 C17.1 | v4.5,17.5 1.1,17.5 0.6,18 0.6,24.2 1.9,25.5 5.9,25.5 v6.1,25.3 R7.1 | U8.23 41.28,10.9 41.9,10.9 42.3,10.5 42.3,9.3 42.45,9.15 C19.1 | v44.5,11.8 44.7,11.6
  Top 0.3: R5.1 C7.1 1.7,1.95 v1.7,0.9 | U5.5 7.89,4.91 v8.5,4.3 | 10.3,20.3 D5.C 10.2,20.3 | 12.7,20.3 D4.C 12.8,20.3 | 15.2,20.3 D3.C 15.3,20.3 | D2.C 17.8,20.3 | v28.7,5.9 | D1.C 73.65,19.25 v73.7,19.3 | v15.6,3.3 S1.4 | v38.8,18.3 38.8,18.9 C17.1 | v59,2.8 59,2
  Top 0.5: S1.4 18.4,5.45 | 18.4,5.45 S1.3 24.75,5.45 v24.8,5.5 | 10.3,20.3 12.7,20.3 | 12.8,20.3 15.2,20.3 | C15.1 C18.1 | C20.1 C21.1 v28.7,5.9 | 10.2,20.3 7.5,20.3 5.4,20.3 4.5,19.4 v4.5,17.5 4.5,15.54 X5.1 7.64,12.4 9.59,12.4 SV2.4 | v26.75,5.75 26.55,5.55 C8.1 | 18.4,5.45 18.4,9 17.2,10.2 15.2,10.2 15,10 11.6,10 11.2,10.4 11.2,11.2 10.19,12.21 SV2.4 | 17.7,20.3 27.9,20.3 C15.1 | 15.3,20.3 17.7,20.3 | 17.7,20.3 D2.C | 10.19,12.71 SV2.4 | v28.4,20.8 28.4,19.8 C15.1 | v32.4,20.9 32.4,22.8 33,23.4 38.5,23.4 38.9,23 38.9,22.3 39.4,21.8 40.9,21.8 41.45,21.25 v41.45,20.75 | 31.16,8.1 C20.1 | C20.1 v30.2,8.8 | C19.1 43.75,9.15 v43.8,9.2 44.7,10.1 44.7,11.6 | v41.5,12.6 41.7,12.4 42.4,12.4 42.8,12 44.3,12 v44.5,11.8 | v65.7,19 65.7,14.1 v65.6,14 61.6,14 60.1,15.5 60.1,19.2 59.1,20.2 v53.1,20.2 49.4,20.2 v48.9,20.7 | U3.GND2 52.05,9.21 v52.05,7.45 | v40.5,17.2 39.4,18.3 v38.8,18.3
  Top 1: U1.2 73.5,12 | 73.5,12 C3.- | C1.- 73.5,12 | U3.GND 66.35,9.15 67.5,8 67.5,4 65.5,2 59,2 57.5,2 56,3.5 53.55,3.5 v53.25,3.2
  Bottom 0.2: R7.1 v6.1,25.3
  Bottom 0.3: 11,0.9 v1.7,0.9 | 11,0.9 14.8,0.9 15.6,1.7 v15.6,3.3 | v8.5,4.3 10,4.3 11,3.3 11,0.9 | X6.6 59.9,6.1 59,5.2 v59,2.8 | U3.MS3 U3.MS2 U3.MS1 66.35,19.65 v65.7,19 | v73.7,19.3 78.4,19.3 78.5,19.2 | C6.1 46.95,12.15 | C4.2 32.65,17.05 33.5,17.9 33.5,19 32.4,20.1 v32.4,20.9 | 44.98,14.18 U6.1 46.83,14.18 47.45,13.55 | U6.10 44.17,20.02 43.6,20.6 43.75,20.75 X2.1 | C6.1 46.85,12 | v44.5,11.8 44.6,11.9 C6.1 | U7.19 56.5,14.82 56.48,14.8 | 56.48,14.18 U7.1 53.23,14.18 52.58,14.82 U6.19 48.73,14.82 47.45,13.55 | 47.45,13.55 46.95,13.05 C6.1 | v53.1,20.2 53.27,20.02 U7.10 55.17,20.02 56.48,18.73 56.48,14.8 | 56.48,14.18 56.48,14.8 | 56.48,14.18 56.48,12.93 C5.1
  Bottom 0.5: X7.4 52.05,6.1 | 52.05,6.1 X7.3 | X7.22 34.05,6.1 | 34.05,6.1 X7.21 | v28.7,5.9 28.4,6.2 27.2,6.2 v26.75,5.75 26.5,5.5 v24.8,5.5 | 66.9,15 68.53,13.37 68.53,13.23 | v40.5,17.2 40.9,16.8 40.9,13.2 v41.5,12.6 | v32.4,20.9 32.22,20.72 U4.8 28.48,20.72 v28.4,20.8 | v30.2,8.8 31.2,7.8 33.6,7.8 34.05,7.35 34.05,6.1 | C19.1 43.75,9.15 v43.8,9.2 | 66.9,15 C2.2 66.65,15.65 65.8,16.5 U2.2 | 66.9,15 65.9,14 v65.6,14 C13.2 | C14.2 v65.7,19 | v52.05,7.45 52.05,6.1 | v38.8,18.3 39,18.3 v41.45,20.75 43.75,20.75 48.85,20.75
  Bottom 1: U3.GND 66.35,11.05 68.53,13.23 C3.- 78.5,18.23 78.5,19.2 X1.1 | 34.05,6.1 34.05,5.05 36.2,2.9 51.75,2.9 | 52.05,6.1 51.75,5.8 51.75,2.9 | 51.75,2.9 53,2.9 53.2,3.1
  other vias: 24.5,16.5 26.6,15.5 22.3,14.7 23.4,10.9 20.8,18.2 25.6,11.1 84,20 84,16 84,12 84,8 80,20 80,16 80,8 80,4 76,4 72,8 64,12 56,16 56,20 16,4 16.5,10.5 4.5,15 3.2,10.9 5,10.2 37,3 42,3 37,4 43,21 44,21 48,23 49,23 32.5,22.5 9,21.5 65.5,12 62.5,12 68.4,16.3 67,14 68,19 70,19 65.5,21 68,21 70,21 74,21 72.5,17.8 80.5,12 9.1,1.3 16,2.4 1.1,20.5 8.8,22.4 31.8,8.8 33.2,7.9 39.4,2.8 59,4.6 80,1.3 76,1.3 72,1.3 76.7,13.8 71.7,11.3 75.2,11.3 76.6,9.1 18.8,11.1 20.3,13.5 20.3,10.3 20.3,11.8 28.5,12.3 27.5,9.4 27,8.3
  pour Top (isolate 0.2): 0.4,2 0.4,24 arc-90 2,25.6 84,25.6 arc-90 85.6,24 85.6,2 arc-90 84,0.4 2,0.4 arc-90
  pour Bottom (isolate 0.2): 0.4,2 0.4,24 arc-90 2,25.6 84,25.6 arc-90 85.6,24 85.6,2 arc-90 84,0.4 2,0.4 arc-90
HEAD_THERM  (via drill 0.4)
  Top 0.2: U8.18 37.7,10.95 v37.7,11.4 | v43.5,4.4 43.85,4.05 R4.1
  Bottom 0.2: v37.7,11.4 38.3,11.4 40.1,9.6 40.1,8.8 41.3,7.6 43.3,7.6 43.54,7.36 X7.12 43.54,4.44 v43.5,4.4
LATCH  (via drill 0.4)
  Top 0.2: U8.32 38.54,17.6 39,17.6 40,16.6 40,16.23 U8.28 39.1,15.33 39.1,15 40.1,14 40.5,14 42.4,15.9 43.1,15.9 43.8,16.6 43.8,18.2 45.5,19.9 47.8,19.9 49.6,18.1 v52.8,18.1
  Bottom 0.2: U7.2 53.48,14.82 53,15.3 53,17.9 v52.8,18.1
LATCH_5V  (via drill 0.4)
  Top 0.2: v58.3,15.5 58.3,12.1 57.7,11.5 55.5,11.5 54.9,10.9 54.9,7.2 49.6,1.9 44.9,1.9 44.7,2.1 44.7,4.2 v44.9,4.4
  Bottom 0.2: X7.15 40.54,4.06 40.9,3.7 44.2,3.7 v44.9,4.4 | v58.3,15.5 58.33,15.47 U7.18
LED1
  Bottom 0.3: U4.3 27.05,17.55 24.7,19.9 20.7,19.9 19.3,21.3 11.7,21.3 X3.5
LED2
  Bottom 0.3: U4.4 27.12,18.18 24.9,20.4 21.1,20.4 19.6,21.9 13.1,21.9 X3.4
LED3  (via drill 0.4)
  Top 0.3: v20.1,22.7 20.1,22.3 19.1,21.3 14.9,21.3 14,22.2 X3.3
  Bottom 0.3: U4.5 27.18,18.82 25.1,20.9 21.5,20.9 20.1,22.3 v20.1,22.7
LED4  (via drill 0.4)
  Top 0.3: v21.1,23.3 20.9,23.5 19.6,23.5 19.2,23.1 19.2,22.3 18.8,21.9 16.3,21.9 16,22.2 X3.2
  Bottom 0.3: U4.6 27.25,19.45 25.3,21.4 21.9,21.4 21.1,22.2 v21.1,23.3
LED5
  Bottom 0.3: U4.7 27.31,20.09 25.5,21.9 22.3,21.9 21.9,22.3 21.9,23.7 21.5,24.1 19.1,24.1 X3.1
LED6
  Bottom 0.3: X4.5 25.4,25.4 33.7,25.4 35,24.1 35,20.9 35.18,20.72 U4.9
LED7
  Bottom 0.3: X4.4 26.8,24.8 33.5,24.8 34.4,23.9 34.4,20.6 34.91,20.09 U4.10
LED8
  Bottom 0.3: X4.3 28.2,24.2 33.3,24.2 33.8,23.7 33.8,20.4 34.75,19.45 U4.11
LED_CLK  (via drill 0.4)
  Top 0.2: v32.4,18.5 32.98,18.5 U8.39
  Bottom 0.2: U4.1 31.88,16.28 32.1,16.5 32.1,18.2 v32.4,18.5
LED_CS  (via drill 0.4)
  Top 0.2: v35.5,9.5 35.39,9.5 U8.12
  Bottom 0.2: v35.5,9.5 35.9,9.1 35.9,7.8 35.6,7.5 34.8,7.5 27.7,14.6 27.7,16.4 28.2,16.9 30.8,16.9 31.01,16.9
  Bottom 0.3: U4.2 30.8,16.9
LED_MISO  (via drill 0.4)
  Top 0.2: U8.40 33.77,17 v34.3,17
  Bottom 0.2: v34.3,17 34.85,17.55 U4.14
LED_MOSI  (via drill 0.4)
  Top 0.2: U8.41 33.6,16.46 v33.6,16.2
  Bottom 0.2: U4.15 35.11,16.91 34.4,16.2 v33.6,16.2
M1A  (via drill 0.6)
  Top 0.8: U3.1A 58.73,9.17 62.8,5.1 v62.8,4.2
  Bottom 0.6: X6.1 68.5,3.2
  Bottom 0.8: v62.8,4.2 62.8,3.2 64,2 67.3,2 68.5,3.2
M1B  (via drill 0.6)
  Top 0.8: v65.4,4.2 65.4,3.7 64.8,3.1 62.1,3.1 61.5,3.7 61.5,4.84 U3.1B
  Bottom 0.6: X6.3 66.5,4.7 66,4.2 v65.4,4.2
M2A  (via drill 0.6)
  Top 0.8: U3.2A 61.27,8.23 64.1,5.4 v64.1,4.2
  Bottom 0.6: X6.2 67.5,3.9
  Bottom 0.8: v64.1,4.2 64.1,3.6 64.6,3.1 66.7,3.1 67.5,3.9
M2B
  Bottom 0.6: 65.5,8.46 X6.4
  Bottom 0.8: U3.2B 65.5,8.46
MOT_DIR  (via drill 0.4)
  Top 0.2: U8.27 40.4,15.93 40.4,16.02 43.08,18.7 43.7,18.7 45.3,20.3 48,20.3 49.1,19.2 v52.3,19.2
  Bottom 0.2: U3.DIR 52.3,21.66 v52.3,19.2
MOT_EN  (via drill 0.4)
  Top 0.2: U8.14 36.6,9.22 36.6,12 v37.4,12.8
  Bottom 0.2: U3./EN 67.54,24.2 50.2,24.2 50,24 43.4,24 43,23.6 43,22.2 42.7,21.9 41.3,21.9 38.2,18.8 38.2,16.6 37.4,15.8 v37.4,12.8
MOT_STP  (via drill 0.4)
  Top 0.2: U8.10 34.4,9.93 34.4,15.9 35.1,16.6 35.1,20.6 34.8,20.9 34.8,22.1 35.4,22.7 36.8,22.7 v37,22.5 | v37,25.3 51.2,25.3 U3.STEP
  Bottom 0.2: v37,22.5 v37,25.3
MOT_THERM  (via drill 0.4)
  Top 0.2: U8.19 38.4,10.95 38.4,12.1 v38.9,12.6
  Bottom 0.2: X6.5 64.5,7.4 64,7.9 61,7.9 59.2,6.1 58.5,6.1 | v38.9,12.6 38.9,11.4 40.5,9.8 40.5,9 41.3,8.2 54.5,8.2 55.3,7.4 55.3,6.4 55.6,6.1 58.5,6.1 | R3.1 58.5,7.05 58.5,6.1
N$1
  Bottom 0.2: X8.4 8,7.8 8.7,8.5 12.7,8.5 15.9,5.3 17.4,5.3 19.85,2.85 R1.1
N$2
  Bottom 0.3: U3./SLP U3./RST
N$3  (via drill 2.2 pad 4)
  other vias: 3,8.2
N$4  (via drill 2.2 pad 4)
  other vias: 83,3
N$5  (via drill 2.2 pad 4)
  other vias: 83,23
N$6  (via drill 2.2 pad 4)
  other vias: 3,23
N$8
  Top 0.2: S1.1 23.95,0.95 23.6,1.3 23.6,1.5 | 28.15,3.6 R8.1 | 28.15,3.6 23.8,3.6 23.3,3.1 23.3,1.25 S1.1 | S1.2 16.15,0.4 23.05,0.4 S1.1 | 28.15,3.6 28.15,4.4 C8.2 28.25,5.25 27.8,5.7 27.8,6.4 29.2,7.8 29.2,9 29.7,9.5 31.85,9.5 U8.7
N$9
  Top 0.2: C12.1 21.05,15.3 24.45,15.3 Q2.1 24.5,14.5 24.7,14.3 26.4,14.3 26.8,13.9 26.8,11.5 27.5,10.8 31.03,10.8 U8.4
N$10
  Top 0.2: C11.1 22.7,17.75 Q2.2 24.5,17.5 25.8,16.2 25.8,14.9 26,14.7 26.6,14.7 27.2,14.1 27.2,11.7 27.7,11.2 30.73,11.2 U8.3
N$11
  Top 0.2: Q1.3 23.45,12.7 24.1,12.7 24.5,12.3 24.5,10.8 24.9,10.4 31.34,10.4 U8.5
  Top 0.3: C10.1 22.7,13.45 Q1.3
N$14
  Top 0.2: U8.6 31.65,10 27.1,10 26.8,9.7 26.8,9.3 26.5,9 25.65,9 Q1.1
  Top 0.3: C9.1 21.5,8 22,7.5 25.4,7.5 25.6,7.7 Q1.1
N$15  (via drill 0.4)
  Top 0.2: v13.8,19.4 13.8,19.1 13.45,18.75 D4.A
  Bottom 0.2: R12.1 13.45,20.35 13.8,20 v13.8,19.4
N$16
  Top 0.3: R9.1 D1.A
N$17  (via drill 0.4)
  Top 0.2: v16.7,19.4 17.35,18.75 D2.A
  Bottom 0.2: R10.1 17.05,20.35 16.7,20 v16.7,19.4
N$18  (via drill 0.4)
  Top 0.2: v14.4,18.5 14.65,18.75 D3.A
  Bottom 0.2: R11.1 14.75,20.35 14.5,20.1 14.5,18.6 v14.4,18.5
N$19
  Bottom 0.5: U2.4 62.6,14.45 C13.1
N$20  (via drill 0.4)
  Top 0.2: v11.3,19.4 10.65,18.75 D5.A
  Bottom 0.2: R13.1 10.35,20.35 10.4,20.3 10.9,20.3 11.3,19.9 v11.3,19.4
PA5  (via drill 0.3, 0.4)
  Top 0.2: SV3.2 14,14.98 14,12.3 13.7,12 v13.7,11 | v21.9,1.5 v21.9,3.5 | U8.15 37.9,8.62 37.9,7.7 37.1,6.9 35.9,6.9 33.1,4.1 33.1,3.5 v32.4,2.8
  Bottom 0.2: SV3.2 15.27,18.42 | v21.9,1.5 22.2,1.2 30.9,1.2 31.7,2 31.7,2.3 32.2,2.8 v32.4,2.8 | v21.9,3.5 21.2,4.2 19.7,4.2 17.8,6.1 16.3,6.1 13.7,8.7 v13.7,11
  Bottom 0.3: 15.27,18.42 R11.2
PA7  (via drill 0.3, 0.4)
  Top 0.2: SV3.3 11.5,15.02 11.5,12.2 12.1,11.6 v12.1,10.9 | v20.8,1.2 v20.8,3.5 | U8.17 38.6,9.34 38.6,9 38.3,8.7 38.3,7.5 37.3,6.5 36.1,6.5 33.5,3.9 33.5,2.6 v33.2,2.3
  Bottom 0.2: SV3.3 12.73,18.42 | v20.8,1.2 21.2,0.8 31.1,0.8 32.3,2 32.9,2 v33.2,2.3 | v20.8,3.5 20.5,3.8 19.5,3.8 17.6,5.7 16.1,5.7 12.1,9.7 v12.1,10.9
  Bottom 0.3: 12.73,18.42 R12.2
PA15  (via drill 0.4)
  Top 0.2: v8.9,24.5 9.2,24.8 26.7,24.8 28,23.5 28,22.4 28.4,22 29.7,22 30.3,21.4 30.3,19.9 31,19.2 32.98,19.2 U8.38
  Bottom 0.2: SV3.4 10.19,18.46 | 10.19,18.46 R13.2 | 10.19,18.46 9.44,18.46 9.1,18.8 9.1,19.7 8,20.8 8,23.5 8.9,24.4 v8.9,24.5
PC13  (via drill 0.3, 0.4)
  Top 0.2: SV3.1 16.5,14.94 16.5,12.1 15.4,11 v14.7,11 | U8.2 31.62,12.8 v31.8,12.8 | v35.2,8.2 35.2,7.4 32,4.2 31.4,4.2 30.8,3.6 v30.8,3.5
  Bottom 0.2: v31.8,12.8 31.8,12.1 35.2,8.7 v35.2,8.2 | SV3.1 17.81,18.46 | v14.7,11 14.7,8.3 16.5,6.5 18,6.5 19.9,4.6 21.9,4.6 22.7,3.8 22.7,2.4 23.1,2 30.5,2 30.7,2.2 30.7,3.4 v30.8,3.5
  Bottom 0.3: 17.81,18.46 R10.2
PHOTO  (via drill 0.3)
  Top 0.2: U8.13 37.2,7.91 37.2,7.6 36.9,7.3 35.7,7.3 31.9,3.5 v31.8,3.5
  Bottom 0.2: X8.3 9,7.5 9.6,8.1 12.5,8.1 15.7,4.9 17.2,4.9 17.4,4.7 R2.1 17.95,2.85 18.8,2 21.2,2 21.4,2.2 22.3,2.2 22.9,1.6 30.7,1.6 31.2,2.1 31.2,2.7 31.8,3.3 v31.8,3.5
RS485_A  (via drill 0.4)
  Top 0.2: U5.6 4.96,3.63 4.7,3.9 4.7,6.2 v5.6,7.1 | v7,10.8 7,9.32 SJ1.3
  Bottom 0.2: v5.6,7.1 6.6,7.1 7,7.5 v7,10.8
RS485_B
  Top 0.2: U5.7 7.87,2.37 9.5,4 9.5,5 8.8,5.7 7.2,5.7 7,5.9 7,6.98
  Top 0.3: 7,6.98 SJ2.1
RTS  (via drill 0.4)
  Top 0.2: R5.2 3.35,5.35 | U5.2 10.34,2.37 v9.7,3 10.34,3.63 U5.3 13.13,3.63 13.7,4.2 13.7,7 14.3,7.6 16.5,7.6 16.8,7.9 v16.8,9.2 | v26,2.7 26,2 26.8,1.2 33.8,1.2 34.3,1.7 34.3,3.5 36.5,5.7 37.7,5.7 39.1,7.1 39.7,7.1 40,7.4 v40,7.8 40,7.7 | v35.5,11.5 35.2,11.8 35.2,15.5 36.6,16.9 37.13,16.9 U8.33
  Top 0.3: 3.35,5.35 v3.4,5.4
  Bottom 0.2: v3.4,5.4 3.8,5.8 6.5,5.8 7.1,5.2 7.1,4.5 8.6,3 v9.7,3 | v16.8,9.2 16.8,8 17.1,7.7 18.6,7.7 20.5,5.8 22.5,5.8 24.5,3.8 25.2,3.8 26,3 v26,2.7 | v35.5,11.5 35.6,11.5 36.2,10.9 36.2,10.5 38.2,8.5 39.4,8.5 40,7.9 v40,7.8
RX  (via drill 0.4)
  Top 0.2: U5.1 12.89,1.09 13.3,1.5 13.3,1.8 | v12.3,6.4 11.7,7 SJ2.3 | v17.5,8.5 17.5,7.9 16.8,7.2 14.5,7.2 14.1,6.8 14.1,4 13.3,3.2 13.3,1.8 | v14,1.7 13.4,1.7 13.3,1.8 | v27,2.7 26.8,2.5 26.8,1.8 27,1.6 33.6,1.6 33.9,1.9 33.9,3.7 36.3,6.1 37.5,6.1 39,7.6 v39,7.8 | v35.5,10.5 35.6,10.5 36.2,11.1 36.2,11.9 35.6,12.5 35.6,15.3 36.8,16.5 38.15,16.5 U8.31
  Bottom 0.2: v12.3,6.4 13.6,6.4 14.8,5.2 14.8,2.2 14.3,1.7 v14,1.7 | v17.5,8.5 17.9,8.1 18.8,8.1 20.7,6.2 22.7,6.2 24.7,4.2 25.7,4.2 27,2.9 v27,2.7 | v35.5,10.5 35.6,10.5 38.3,7.8 v39,7.8
STROBE  (via drill 0.4)
  Top 0.2: 37.77,9.43 U8.16 37,10.23 37,11.8 37.3,12.1 37.7,12.1 38.1,12.5 v38.1,13.6 | v42.1,18.8 v43.1,19.8
  Bottom 0.2: v42.1,18.8 42,18.7 40.9,18.7 39.8,17.6 39.8,15.3 v38.1,13.6 | v43.1,19.8 43.52,19.38 U6.9
STROBE_5V  (via drill 0.4)
  Top 0.2: v42.5,4.4 42.5,5 42.8,5.3 44,5.3 47.3,8.6 47.3,16.9 47.1,17.1 47.1,18.9 v47.4,19.2
  Bottom 0.2: U6.11 49.33,20.02 48.5,19.2 v47.4,19.2 | X7.13 42.54,4.44 v42.5,4.4
SWCLK  (via drill 0.4)
  Top 0.2: v7.9,24.5 7.9,24.9 8.2,25.2 28.3,25.2 30,23.5 30,22.3 30.7,21.6 30.7,20.1 31.2,19.6 33.29,19.6 U8.37
  Bottom 0.2: SV2.3 12.73,13.07 10.7,15.1 9.6,15.1 9,15.7 9,16.7 9.4,17.1 9.4,17.7 8.7,18.4 8.7,19.5 7.6,20.6 7.6,24.1 7.9,24.4 v7.9,24.5
SWDIO  (via drill 0.4)
  Top 0.2: SV2.2 15.27,14.47 16.5,15.7 16.5,16.9 15.8,17.6 8.8,17.6 v8.6,17.4 | v7.1,25.3 7.4,25.6 35.6,25.6 v35.9,25.3 | v35.9,21.5 35.9,17.8 36.4,17.3 36.83,17.3 U8.34
  Bottom 0.2: v8.6,17.4 8.3,17.7 8.3,19.3 7.1,20.5 v7.1,25.3 | v35.9,25.3 v35.9,21.5
TX  (via drill 0.4)
  Top 0.2: U5.4 13.01,4.91 13.3,5.2 13.3,8 | SJ1.1 10.02,8.98 11,8 13.3,8 | v16.1,8.5 15.6,8 13.3,8 | v25,2.7 25,2.4 26.6,0.8 34,0.8 34.7,1.5 34.7,3.3 36.7,5.3 37.9,5.3 39.3,6.7 40,6.7 40.7,7.4 40.7,8.2 39.7,9.2 v39.3,9.2 | v36.4,12.8 36,13.2 36,15.1 37,16.1 38.45,16.1 U8.30
  Bottom 0.2: v16.1,8.5 16.1,8.1 16.9,7.3 18.4,7.3 20.3,5.4 22.3,5.4 24.3,3.4 24.6,3.4 25,3 v25,2.7 | v36.4,12.8 36.6,12.6 36.6,10.7 38.1,9.2 v39.3,9.2

### Text on the board
tPlace: 0 | 1 | 2 | 3 | 4 | 5 | 6 | 7 | 8 | 5V | LED | SIG | 5V | GND | LED0-4 | LED5-8 | Button | + - | max. 8,5V | B0 | PA15 | PA7 | PA5 | PC13 | B1 | TX | RX | GND | GND | 3.3v | SWCLK | SWDIO | UART | Reset | RS485
bPlace: Sensor | Printhead | Motor